# Altium project 3LED_3Button.PrjPcb
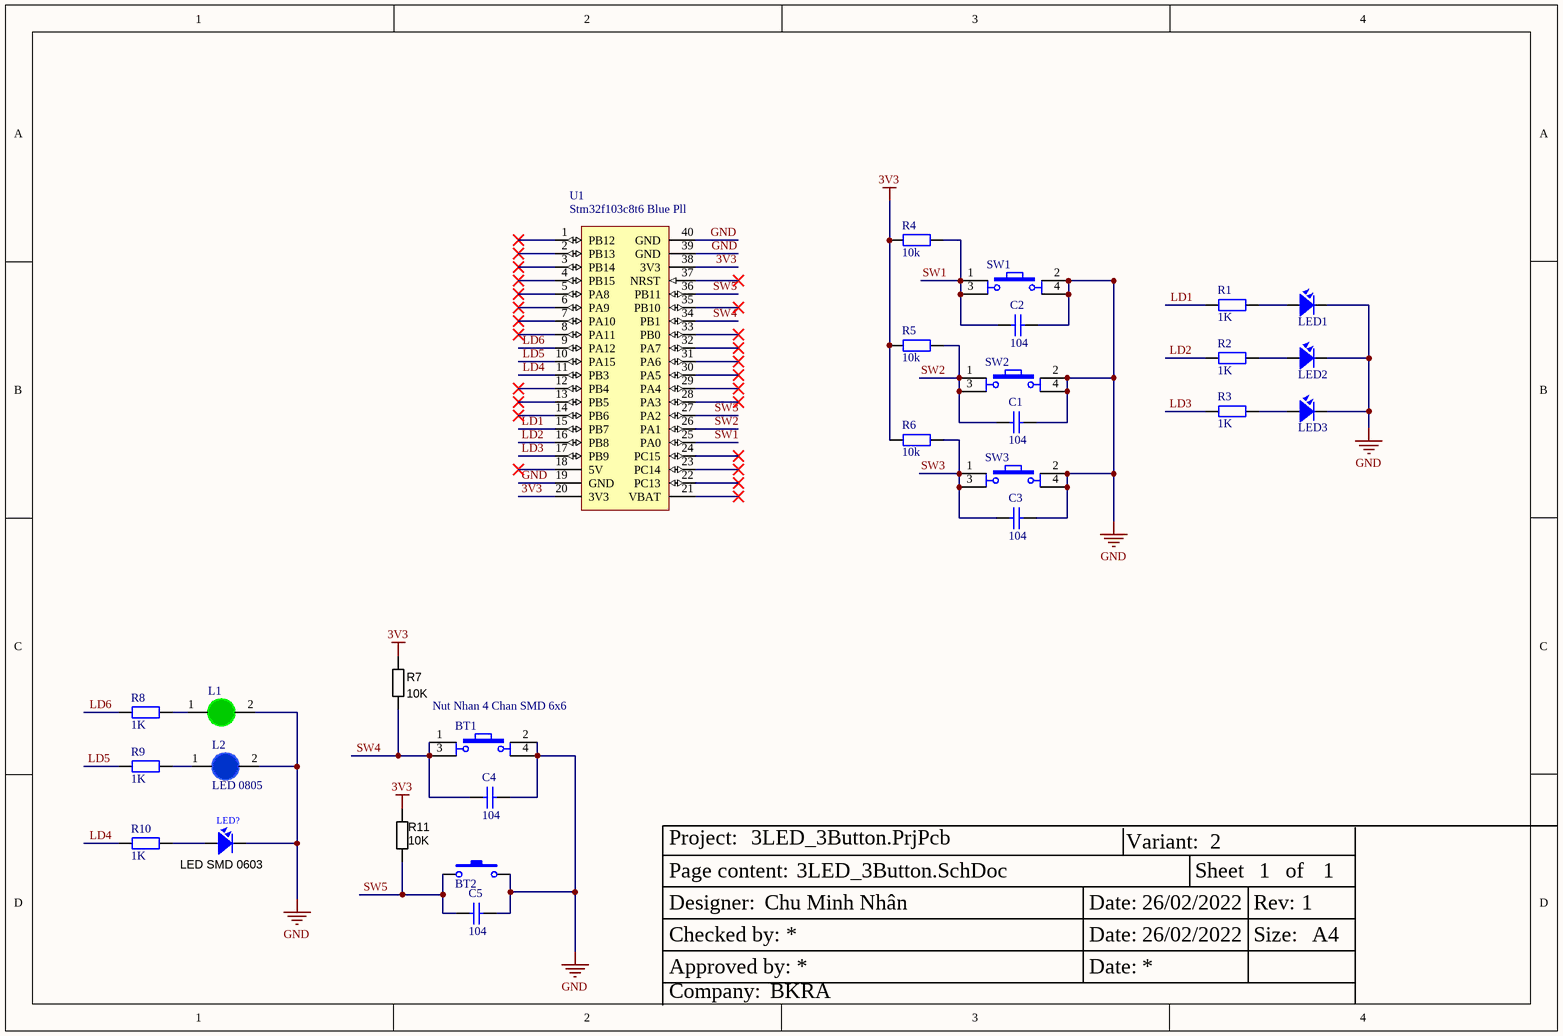
[diagram p0: 3LED_3Button.SchDoc]
1 sheet, 28 parts. Net scope: global (net labels, ports and power ports of the same name join across sheets).
Board file: 3LED_3Button.PcbDoc

## Sheet 3LED_3Button.SchDoc
size A4; SheetSize: A4; Variant: 2; DateDesigned: 26/02/2022; DateChecked: 26/02/2022; Author: Chu Minh Nhân; CompanyName: BKRA; Engineer: Chu MInh Nhân; Organization: Altium Limited; Address1: L3, 12a Rodborough Rd; Address2: Frenchs Forest; Address3: NSW; Address4: Australia 2086; Revision: 1; SheetNumber: 1; SheetTotal: 1

### Parts
BT1  Nut Nhan 4 Chan SMD 6x6  [Nut Nhan 4 Chan SMD 6x6]
BT2  Nut Nhan 2 Chan SMD 3x6x2.5  [Nut Nhan 2 Chan SMD 3x6x2.5]  (value not drawn)
C1  104  [tu gom]
C2  104  [tu gom]
C3  104  [tu gom]
C4  104  [tu 0603]
C5  104  [tu 0603]
L1  LED 0805  [LED-1206-Green]  (value not drawn)
L2  LED 0805  [LED-1206-Blue]
LED1  LED  [LED-3]  (value not drawn)
LED2  LED  [LED-3]  (value not drawn)
LED3  LED  [LED-3]  (value not drawn)
LED?  LED SMD 0603  [LED-0603-GREEN]
R1  1K  [tro vach 1/4w]
R2  1K  [tro vach 1/4w]
R3  1K  [tro vach 1/4w]
R4  10k  [tro vach 1/2w]
R5  10k  [tro vach 1/2w]
R6  10k  [tro vach 1/2w]
R7  value 10K  [RESC1005X40N]  (hidden comment: Thick Film)
R8  1K  [tro smd 1206]
R9  1K  [tro smd 0805]
R10  1K  [tro smd 0603]
R11  value 10K  [RESC1005X40N]  (hidden comment: Thick Film)
SW1  SW  [SW4]  (value not drawn)
SW2  SW  [SW4]  (value not drawn)
SW3  SW  [SW4]  (value not drawn)
U1  stm32f103 blue pill  [Stm32F103c8t6 Blue Pill]  (value not drawn)

### Nets
3V3: R4.2 R5.1 R6.1 R7.2 R11.2 U1.20(3V3) U1.38(3V3)
GND: BT1.2 BT1.4 BT2.2 C1.1 C2.1 C3.1 C4.1 C5.1 L1.2(K) L2.2(K) LED1.2 LED2.2 LED3.2 LED?.K SW1.2 SW1.4 SW2.2 SW2.4 SW3.2 SW3.4 U1.19(GND) U1.39(GND) U1.40(GND)
LD1: R1.1 U1.15(PB7)
LD2: R2.1 U1.16(PB8)
LD3: R3.1 U1.17(PB9)
LD4: R10.2 U1.11(PB3)
LD5: R9.1 U1.10(PA15)
LD6: R8.1 U1.9(PA12)
SW1: C2.2 R4.1 SW1.1 SW1.3 U1.25(PA0)
SW2: C1.2 R5.2 SW2.1 SW2.3 U1.26(PA1)
SW3: C3.2 R6.2 SW3.1 SW3.3 U1.27(PA2)
SW4: BT1.1 BT1.3 C4.2 R7.1 U1.34(PB1)
SW5: BT2.1 C5.2 R11.1 U1.36(PB11)
NetL1_1: L1.1(A) R8.2
NetL2_1: L2.1(A) R9.2
NetLED1_1: LED1.1 R1.2
NetLED2_1: LED2.1 R2.2
NetLED3_1: LED3.1 R3.2
NetLED?_A: LED?.A R10.1

Not connected (* = marked no-connect by the designer): U1 1(PB12)* 2(PB13)* 3(PB14)* 4(PB15)* 5(PA8)* 6(PA9)* 7(PA10)* 8(PA11)* 12(PB4)* 13(PB5)* 14(PB6)* 18(5V)* 21(VBAT)* 22(PC13)* 23(PC14)* 24(PC15)* 28(PA3)* 29(PA4)* 30(PA5)* 31(PA6)* 32(PA7)* 33(PB0)* 35(PB10)* 37(NRST)*

### Notes on the sheet
- Project:
- Variant:
- Page content:
- Designer:
- Date:
- Sheet
- Rev:
- of
- Checked by:
- Approved by:
- Size:
- Company:
- (in symbol stm32f103 blue pill) Stm32f103c8t6 Blue Pll

### Library data of the parts
BT1 = Nut Nhan 4 Chan SMD 6x6: Nut Nhan 4 Chan 6.2x6.2x3.5; Ten: Nút Nhấn 4 Chân 6.2x6.2x3.1MM SMD; Ma_Hang: MH002424
BT2 = Nut Nhan 2 Chan SMD 3x6x2.5: Ma_Hang: MH001036; Ten: Nút Nhấn 2 Chân 3x6x2.5MM SMD
C1-C3 = Tu gom 104 50V: Cắm; So_Chan: 2; Ten_Linh_Kien: Tụ gốm 104 100nF 50V; Don_Vi: Con; Ma_Hang: MH004761; Chung_Loai: Cắm; Kieu_Chan: *
C4 C5 = Tu 0603 104 50V 10%: Dán; Don_Vi: Con; So_Chan: 2; Ten_Linh_Kien: Tụ 0603 104-100nF 10% 50V; Ma_Hang: MH004568; Chung_Loai: Dán; Kieu_Chan: *
L1 = LED 1206 Xanh La: Dán; Don_Vi: Con; Ma_Hang: MH002947; Ten_Linh_Kien: LED1206 Màu Xanh Lá (Green); Ghi_Chu: *; Kieu_Chan: *; Chung_Loai: Dán
L2 = LED 1206 Xanh Duong: Dán; Don_Vi: Con; Ma_Hang: MH002333; Ten_Linh_Kien: LED1206 Màu Xanh Dương (Blue); Ghi_Chu: *; Kieu_Chan: *; Chung_Loai: Dán
LED1-LED3 = LED: LED Single colour Green and Red; Value: LED 3 ly Single Colour
LED? = LED SMD 0603: LED 0603 SMD Green 525nm 350mcd 20mA; Manufacturer 1: Kingbright; Manufacturer Part Number 1: APT1608ZGCK; Material: InGaN; Ratings: 200mcd min; 350 mcd typ @ 20mA; Voltage - Forward (Vf) @ 10mA: 3.1V; Viewing Angle: 120°; Lens Style/Size: Rectangle with Flat Top, 1.2mm x 0.8mm; Voltage - Forward (Vf) @ 20mA: 3.3V; SCDType: source; Package / Case: 0603 (1608 metric); Color: Green; Current - Test: 20mA; Manufacturer 2: Kingbright Company LLC; Manufacturer Part Number 2: APT1608-WAP24; Supplier 1: Mouser; Supplier Part Number 1: 604-APT1608ZGCK; ComponentLink1URL: http://www.mouser.com/ds/2/216/APT1608ZGCK-262051.pdf; ComponentLink1Description: http://www.mouser.com/ds/2/216/APT1608ZGCK-262051.pdf; ComponentLink2Description: APT1608-WAP24 Datasheet; ComponentLink2URL: \\SVFI2\PBLShare\Eng\Electrical Engineering\Hardware\Altium\Libraries and Templates\Unreleased Components\Part Number Request 2013-10-02\APT1608-WAP24(Ver.1B).pdf
R1-R3 = Tro Vach 1/4W 5% 680k: Cắm; Don_Vi: Con; So_Chan: 2; Ten_Linh_Kien: Trở Vạch 1/4w 5% 680k; Ma_Hang: MH007330; Chung_Loai: Cắm; Kieu_Chan: *
R4-R6 = Tro Vach 1/2W 5% 10k: Cắm; Don_Vi: Con; So_Chan: 2; Ten_Linh_Kien: Trở 5% 1/2w 10k; Ma_Hang: MH006206; Chung_Loai: Cắm; Kieu_Chan: *
R7 R11 = RES_0402: Resistor SMD chip 1k Ohm 0.063W 5% 0402; Manufacturer 1: Yageo; Manufacturer Part Number 1: RC0402JR-071KL; Ratings: 1/16 W; SCDType: spec; Package / Case: 0402 (1005 Metric); Tolerance: ±5%; Supplier 1: Digi-Key; Supplier Part Number 1: 311-1.0KJRCT-ND; RoHS 1: RoHS Compliant; ComponentLink1URL: http://www.yageo.com/documents/recent/PYu-RC0402_51_RoHS_L_6.pdf; ComponentLink1Description: http://www.yageo.com/documents/recent/PYu-RC0402_51_RoHS_L_6.pdf; Supplier 2: Digi-Key; Supplier Part Number 2: 541-1.0KJCT-ND; Manufacturer 2: Vishay Dale; Manufacturer Part Number 2: CRCW04021K00JNED; RoHS 2: RoHS Compliant; ComponentLink2URL: http://www.vishay.com/doc?20035; ComponentLink2Description: http://www.vishay.com/doc?20035; Supplier 3: Digi-Key; Supplier Part Number 3: 1276-4376-1-ND; Manufacturer 3: Samsung Electro-Mechanics America, Inc; Manufacturer Part Number 3: RC1005J102CS; RoHS 3: RoHS Compliant; ComponentLink3URL: http://www.samsungsem.com/servlet/FileDownload?filename=productcatalog/pdf/Chip_Resistor.pdf; ComponentLink3Description: http://www.samsungsem.com/servlet/FileDownload?filename=productcatalog/pdf/Chip_Resistor.pdf; Supplier 4: Digi-Key; Supplier Part Number 4: RHM1.0KCECT-ND; Manufacturer 4: Rohm Semiconductor; Manufacturer Part Number 4: MCR01MRTJ102; RoHS 4: RoHS Compliant; ComponentLink4URL: http://rohmfs.rohm.com/en/products/databook/datasheet/passive/resistor/chip_resistor/mcr_g.pdf; ComponentLink4Description: http://rohmfs.rohm.com/en/products/databook/datasheet/passive/resistor/chip_resistor/mcr_g.pdf; Supplier 5: Digi-Key; Supplier Part Number 5: P1.0KJCT-ND; Manufacturer 5: Panasonic Electronic Components; Manufacturer Part Number 5: ERJ-2GEJ102X; RoHS 5: RoHS Compliant; ComponentLink5URL: http://industrial.panasonic.com/www-cgi/jvcr13pz.cgi?E+PZ+3+AOA0001+ERJ2GEJ102X+7+WW; ComponentLink5Description: http://industrial.panasonic.com/www-cgi/jvcr13pz.cgi?E+PZ+3+AOA0001+ERJ2GEJ102X+7+WW
R8 = Tro 1206 5% 680R: Dán; Don_Vi: Con; So_Chan: 2; Ten_Linh_Kien: Trở 1206 5% 680R; Ma_Hang: MH005928; Chung_Loai: Dán; Kieu_Chan: *
R9 = Tro 0805 1% 680R: Dán; Don_Vi: Con; So_Chan: 2; Ten_Linh_Kien: Trở 0805 1% 680R; Ma_Hang: MH005487; Chung_Loai: Dán; Kieu_Chan: *
R10 = Tro 0603 1% 680R: Dán; Don_Vi: Con; So_Chan: 2; Ten_Linh_Kien: Trở 0603 1% 680R; Ma_Hang: MH006336; Chung_Loai: Dán; Kieu_Chan: *
SW1-SW3 = SW4: Switch button 4 pin; Value: Button chip 4 pin